# Altium schematic sheet Board.SchDoc
size 420 x 297 mm; Address1: Address1; Address2: Address2; Address3: Address3; Address4: Address4; DocumentNumber: АБВГ.123456.001 Э3; SheetNumber: 3; SheetTotal: 3; Scale: 1:1; DocumentType: Схема электрическая принципиальная; FirstReferrence: АБВГ.123456.001
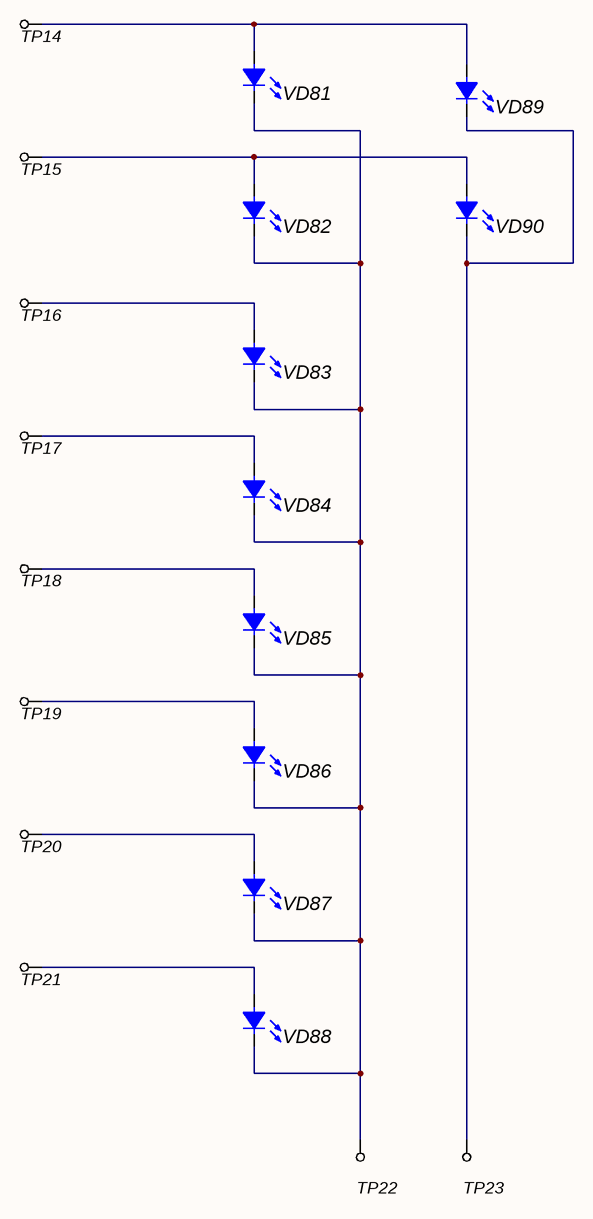
[diagram p0: Board.SchDoc]

## Parts
TP14  Testpoint_HS1mm  [TestPoint(without 3D)]  (value not drawn)
TP15  Testpoint_HS1mm  [TestPoint(without 3D)]  (value not drawn)
TP16  Testpoint_HS1mm  [TestPoint(without 3D)]  (value not drawn)
TP17  Testpoint_HS1mm  [TestPoint(without 3D)]  (value not drawn)
TP18  Testpoint_HS1mm  [TestPoint(without 3D)]  (value not drawn)
TP19  Testpoint_HS1mm  [TestPoint(without 3D)]  (value not drawn)
TP20  Testpoint_HS1mm  [TestPoint(without 3D)]  (value not drawn)
TP21  Testpoint_HS1mm  [TestPoint(without 3D)]  (value not drawn)
TP22  Testpoint_HS1mm  [TestPoint(without 3D)]  (value not drawn)
TP23  Testpoint_HS1mm  [TestPoint(without 3D)]  (value not drawn)
VD81  (no value)  [LED: 1206Y]
VD82  (no value)  [LED: 1206Y]
VD83  (no value)  [LED: 1206Y]
VD84  (no value)  [LED: 1206Y]
VD85  (no value)  [LED: 1206Y]
VD86  (no value)  [LED: 1206Y]
VD87  (no value)  [LED: 1206Y]
VD88  (no value)  [LED: 1206Y]
VD89  (no value)  [LED: 1206Y]
VD90  (no value)  [LED: 1206Y]

## Nets
NetTP14_1: TP14.1 VD81.1(A) VD89.1(A)
NetTP15_1: TP15.1 VD82.1(A) VD90.1(A)
NetTP16_1: TP16.1 VD83.1(A)
NetTP17_1: TP17.1 VD84.1(A)
NetTP18_1: TP18.1 VD85.1(A)
NetTP19_1: TP19.1 VD86.1(A)
NetTP20_1: TP20.1 VD87.1(A)
NetTP21_1: TP21.1 VD88.1(A)
NetTP22_1: TP22.1 VD81.2(C) VD82.2(C) VD83.2(C) VD84.2(C) VD85.2(C) VD86.2(C) VD87.2(C) VD88.2(C)
NetTP23_1: TP23.1 VD89.2(C) VD90.2(C)

## Notes on the sheet
- Перв. примен.
- Справ. №
- Подп. и дата
- Инв. № дубл.
- Взам. инв. №
- Разраб.
- Изм.
- Лист
- № докум.
- Подп.
- Дата
- Лит.
- Масса
- Масштаб
- Пров.
- Т.контр.
- Листов
- Инв. № подл.
- Утв.
- Н.контр.
- 2.106-A3
- Копировал
- Формат А3

## Library data of the parts
VD81-VD90 = LED_single: ValueManufacturerPartNumber: LED, Green, *, *, *, -55...+150°C; TypeDiode: LED; ColorParameter: Green; Manufacturer: *; Package: *; HelpURL: *; Temperature: -55...+150°C; Current: *; VoltageDrop: *; PartNumber: *; Color: GREEN